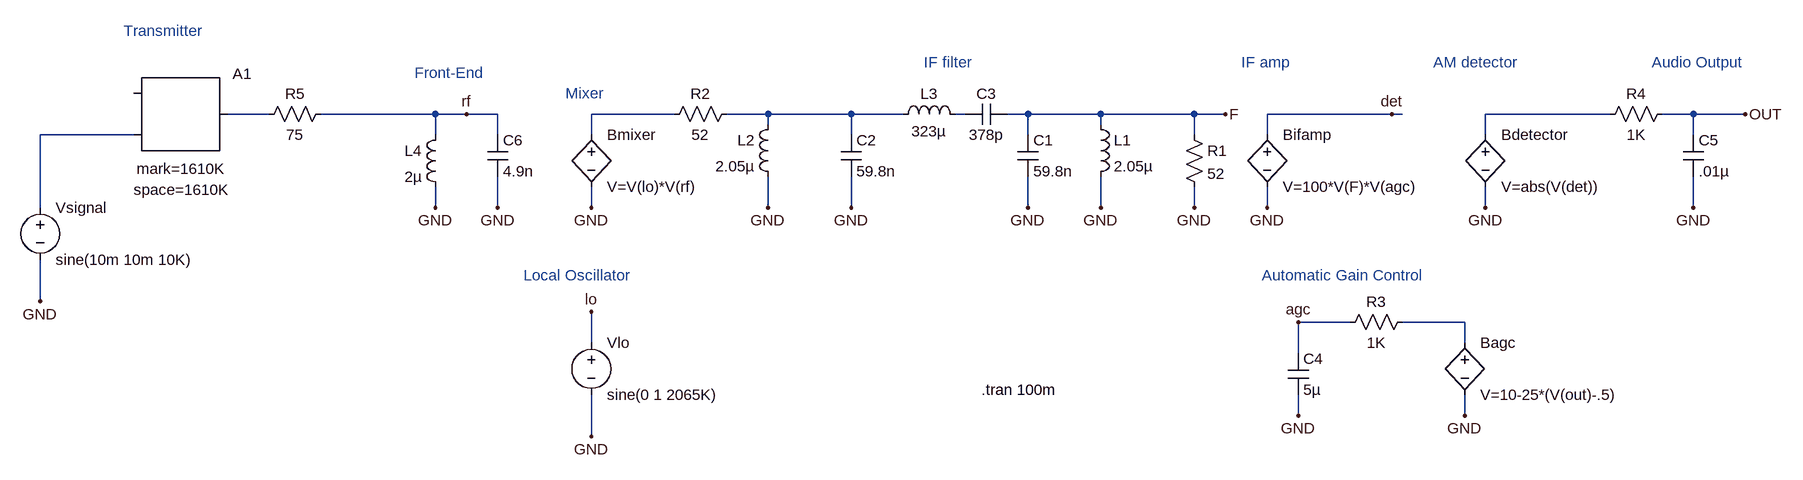
[diagram p0: schematic system.asc]
system.asc, the LTspice schematic file:
Version 4
SHEET 1 3788 1524
WIRE 2864 1008 2864 1040
WIRE 2864 1120 2864 1152
WIRE 2064 1008 1936 1008
WIRE 2976 1152 2976 1120
WIRE 2976 1040 2976 1008
WIRE 2976 1008 3168 1008
WIRE 2864 1008 2912 1008
WIRE 3168 1008 3184 1008
WIRE 3312 1152 3312 1120
WIRE 3312 1040 3312 1008
WIRE 3312 1008 3504 1008
WIRE 3280 1472 3280 1440
WIRE 3280 1360 3280 1328
WIRE 3024 1472 3024 1440
WIRE 3024 1376 3024 1328
WIRE 3024 1328 3104 1328
WIRE 3184 1328 3280 1328
WIRE 1936 1312 1936 1360
WIRE 1936 1440 1936 1504
WIRE 3584 1008 3632 1008
WIRE 3632 1008 3632 1040
WIRE 3632 1104 3632 1152
WIRE 3632 1008 3712 1008
WIRE 1936 1152 1936 1120
WIRE 1936 1040 1936 1008
WIRE 1088 1232 1088 1296
WIRE 1376 1008 1440 1008
WIRE 1232 1040 1088 1040
WIRE 1088 1040 1088 1152
WIRE 1696 1152 1696 1120
WIRE 1696 1040 1696 1008
WIRE 1792 1152 1792 1104
WIRE 1792 1040 1792 1008
WIRE 1744 1008 1792 1008
WIRE 1696 1008 1744 1008
WIRE 1520 1008 1696 1008
WIRE 2208 1152 2208 1104
WIRE 2208 1024 2208 1008
WIRE 2208 1008 2336 1008
WIRE 2496 1008 2512 1008
WIRE 2576 1008 2608 1008
WIRE 2720 1008 2720 1024
WIRE 2720 1104 2720 1152
WIRE 2336 1152 2336 1104
WIRE 2336 1040 2336 1008
WIRE 2336 1008 2416 1008
WIRE 2608 1008 2608 1040
WIRE 2608 1104 2608 1152
WIRE 2608 1008 2720 1008
WIRE 2720 1008 2864 1008
WIRE 2208 1008 2144 1008
FLAG 2864 1152 GND
FLAG 2976 1152 GND
FLAG 2912 1008 F
FLAG 3168 1008 det
FLAG 3312 1152 GND
FLAG 3712 1008 OUT
FLAG 3280 1472 GND
FLAG 3024 1472 GND
FLAG 3024 1328 agc
FLAG 1936 1504 GND
FLAG 3632 1152 GND
FLAG 1936 1152 GND
FLAG 1936 1312 lo
FLAG 1088 1296 GND
FLAG 1744 1008 rf
FLAG 1792 1152 GND
FLAG 1696 1152 GND
FLAG 2720 1152 GND
FLAG 2608 1152 GND
FLAG 2336 1152 GND
FLAG 2208 1152 GND
SYMBOL res 2848 1024 R0
SYMATTR InstName R1
SYMATTR Value 52
SYMBOL res 2160 992 R90
WINDOW 0 0 56 VBottom 0
WINDOW 3 32 56 VTop 0
SYMATTR InstName R2
SYMATTR Value 52
SYMBOL bv 2976 1024 R0
SYMATTR InstName Bifamp
SYMATTR Value V=100*V(F)*V(agc)
SYMBOL bv 3312 1024 R0
SYMATTR InstName Bdetector
SYMATTR Value V=abs(V(det))
SYMBOL bv 3280 1344 R0
SYMATTR InstName Bagc
SYMATTR Value V=10-25*(V(out)-.5)
SYMBOL res 3200 1312 R90
WINDOW 0 0 56 VBottom 0
WINDOW 3 32 56 VTop 0
SYMATTR InstName R3
SYMATTR Value 1K
SYMBOL cap 3008 1376 R0
SYMATTR InstName C4
SYMATTR Value 5µ
SYMBOL voltage 1936 1344 R0
SYMATTR InstName Vlo
SYMATTR Value sine(0 1 2065K)
SYMBOL res 3600 992 R90
WINDOW 0 0 56 VBottom 0
WINDOW 3 32 56 VTop 0
SYMATTR InstName R4
SYMATTR Value 1K
SYMBOL cap 3616 1040 R0
SYMATTR InstName C5
SYMATTR Value .01µ
SYMBOL bv 1936 1024 R0
SYMATTR InstName Bmixer
SYMATTR Value V=V(lo)*V(rf)
SYMBOL voltage 1088 1136 R0
SYMATTR InstName Vsignal
SYMATTR Value sine(10m 10m 10K)
SYMBOL SpecialFunctions\modulate 1232 976 R0
WINDOW 3 4 116 Left 0
WINDOW 123 0 148 Left 0
SYMATTR InstName A1
SYMATTR Value mark=1610K
SYMATTR Value2 space=1610K
SYMBOL res 1536 992 R90
WINDOW 0 0 56 VBottom 0
WINDOW 3 32 56 VTop 0
SYMATTR InstName R5
SYMATTR Value 75
SYMBOL ind 2704 1008 R0
SYMATTR InstName L1
SYMATTR Value 2.05µ
SYMBOL cap 2592 1040 R0
SYMATTR InstName C1
SYMATTR Value 59.8n
SYMBOL cap 2320 1040 R0
SYMATTR InstName C2
SYMATTR Value 59.8n
SYMBOL ind 2224 1008 M0
SYMATTR InstName L2
SYMATTR Value 2.05µ
SYMBOL ind 2400 1024 R270
WINDOW 0 32 56 VTop 0
WINDOW 3 5 56 VBottom 0
SYMATTR InstName L3
SYMATTR Value 323µ
SYMBOL cap 2576 992 R90
WINDOW 0 0 32 VBottom 0
WINDOW 3 32 32 VTop 0
SYMATTR InstName C3
SYMATTR Value 378p
SYMBOL ind 1712 1024 M0
SYMATTR InstName L4
SYMATTR Value 2µ
SYMBOL cap 1776 1040 R0
SYMATTR InstName C6
SYMATTR Value 4.9n
text 2536 1432 Left 0 !.tran 100m
text 1216 880 Left 0 ;Transmitter
text 1664 944 Left 0 ;Front-End
text 1896 976 Left 0 ;Mixer
text 2448 928 Left 0 ;IF filter
text 2936 928 Left 0 ;IF amp
text 3232 928 Left 0 ;AM detector
text 3568 928 Left 0 ;Audio Output
text 2968 1256 Left 0 ;Automatic Gain Control
text 1832 1256 Left 0 ;Local Oscillator

The netlist it stands for:
* system.asc
R1 F GND 52
R2 N006 N001 52
Bifamp det GND V=100*V(F)*V(agc)
Bdetector N002 GND V=abs(V(det))
Bagc N003 GND V=10-25*(V(out)-.5)
R3 N003 agc 1K
C4 agc GND 5µ
Vlo lo GND sine(0 1 2065K)
R4 OUT N002 1K
C5 OUT GND .01µ
Bmixer N001 GND V=V(lo)*V(rf)
Vsignal N005 GND sine(10m 10m 10K)
A1 0 N005 0 0 0 0 N004 0 MODULATOR mark=1610K space=1610K
R5 rf N004 75
L1 F GND 2.05µ
C1 F GND 59.8n
C2 N006 GND 59.8n
L2 N006 GND 2.05µ
L3 N006 N007 323µ
C3 F N007 378p
L4 rf GND 2µ
C6 rf GND 4.9n
.tran 100m
* Transmitter
* Front-End
* Mixer
* IF filter
* IF amp
* AM detector
* Audio Output
* Automatic Gain Control
* Local Oscillator
.backanno
.end